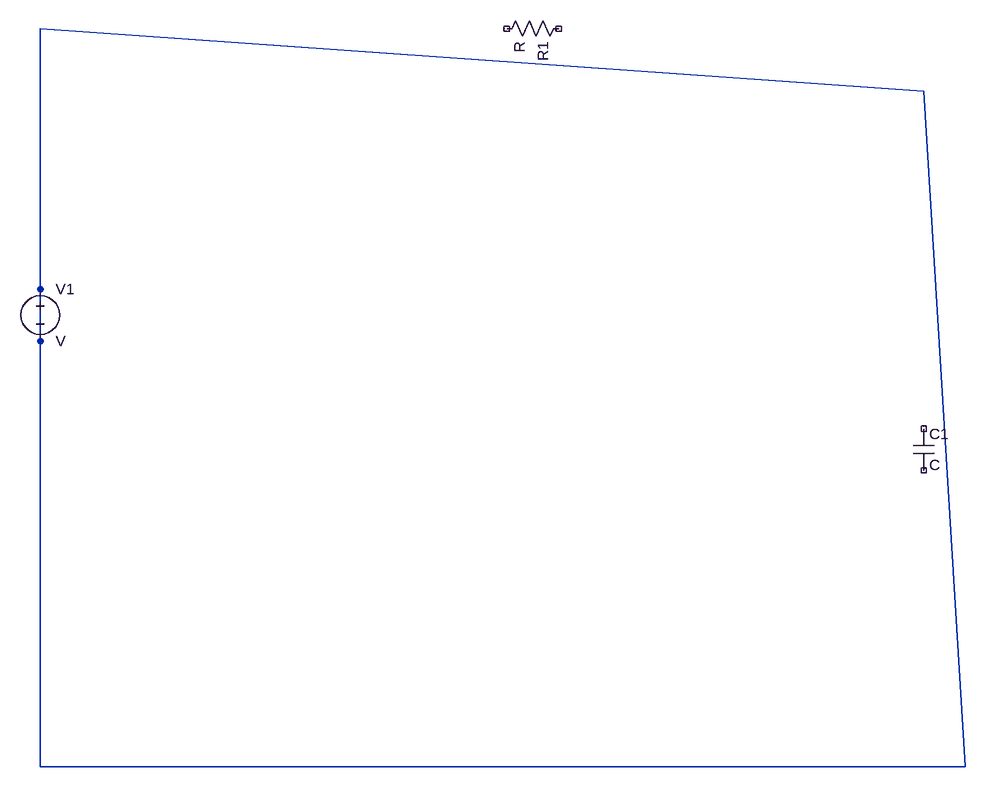
[diagram p0: schematic C3_D1_P2.jpg.asc]
C3_D1_P2.jpg.asc, the LTspice schematic file:
Version 4
SHEET 1 880 680
SYMBOL res 1406 1168 R90
SYMATTR InstName R1
SYMBOL voltage 592 1569 R0
SYMATTR InstName V1
SYMBOL cap 1936 1800 R0
SYMATTR InstName C1
WIRE 592 1184 592 2320
WIRE 592 2320 2016 2320
WIRE 592 1184 1952 1280
WIRE 1952 1280 2016 2320

The netlist it stands for:
* C3_D1_P2.jpg.asc
R1 NC_01 NC_02 R
V1 N001 N001 V
C1 NC_03 NC_04 C
.backanno
.end